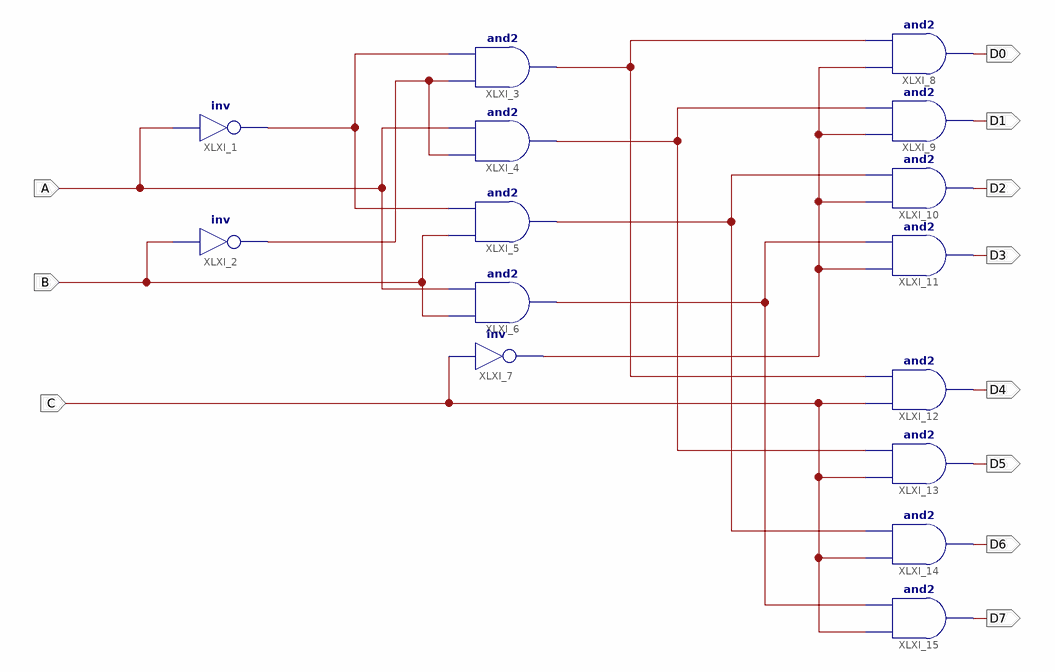
[diagram p0: schematic sheet 1]
// Xilinx ISE schematic Decoder_38.sch (kintex7) as structural Verilog: 15 symbols, 11 ports
module Decoder_38 (
  input  A,
  input  B,
  input  C,
  output D0,
  output D1,
  output D2,
  output D3,
  output D4,
  output D5,
  output D6,
  output D7
);

  wire XLXN_1, XLXN_2, XLXN_8, XLXN_10, XLXN_12, XLXN_14, XLXN_16;

  not XLXI_1 (XLXN_1, A);
  not XLXI_2 (XLXN_2, B);
  and XLXI_3 (XLXN_8, XLXN_2, XLXN_1);
  and XLXI_4 (XLXN_10, XLXN_2, A);
  and XLXI_5 (XLXN_12, B, XLXN_1);
  and XLXI_6 (XLXN_14, B, A);
  not XLXI_7 (XLXN_16, C);
  and XLXI_8 (D0, XLXN_16, XLXN_8);
  and XLXI_9 (D1, XLXN_16, XLXN_10);
  and XLXI_10 (D2, XLXN_16, XLXN_12);
  and XLXI_11 (D3, XLXN_16, XLXN_14);
  and XLXI_12 (D4, C, XLXN_8);
  and XLXI_13 (D5, C, XLXN_10);
  and XLXI_14 (D6, C, XLXN_12);
  and XLXI_15 (D7, C, XLXN_14);
endmodule
